# Altium schematic sheet MidDout.SchDoc
size A4
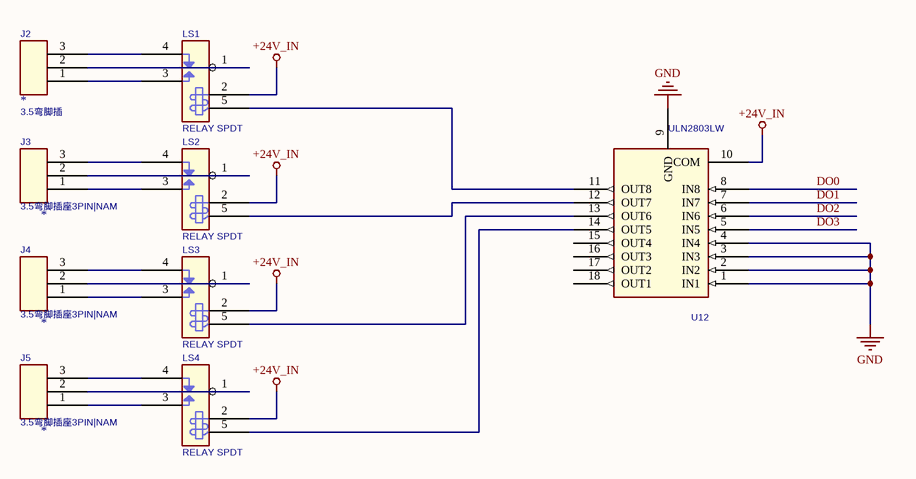
[diagram p0: MidDout.SchDoc]

## Parts
J2  *  [3.5-P3]
J3  *  [3.5-P3]
J4  *  [3.5-P3]
J5  *  [3.5-P3]
LS1  RELAY SPDT  [RELAY_OMRON_G5LE-14]
LS2  RELAY SPDT  [RELAY_OMRON_G5LE-14]
LS3  RELAY SPDT  [RELAY_OMRON_G5LE-14]
LS4  RELAY SPDT  [RELAY_OMRON_G5LE-14]
U12  ULN2803LW  [SO18WN]

## Nets
+24V_IN: LS1.2(COIL2) LS2.2(COIL2) LS3.2(COIL2) LS4.2(COIL2) U12.10(COM)
GND: U12.1(IN1) U12.2(IN2) U12.3(IN3) U12.4(IN4) U12.9(GND)
DO0: U12.8(IN8)
DO1: U12.7(IN7)
DO2: U12.6(IN6)
DO3: U12.5(IN5)
NetJ2_1: J2.1 LS1.3(NO)
NetJ2_2: J2.2 LS1.1(COMMON)
NetJ2_3: J2.3 LS1.4(NC)
NetJ3_1: J3.1 LS2.3(NO)
NetJ3_2: J3.2 LS2.1(COMMON)
NetJ3_3: J3.3 LS2.4(NC)
NetJ4_1: J4.1 LS3.3(NO)
NetJ4_2: J4.2 LS3.1(COMMON)
NetJ4_3: J4.3 LS3.4(NC)
NetJ5_1: J5.1 LS4.3(NO)
NetJ5_2: J5.2 LS4.1(COMMON)
NetJ5_3: J5.3 LS4.4(NC)
NetLS1_5: LS1.5(COIL1) U12.11(OUT8)
NetLS2_5: LS2.5(COIL1) U12.12(OUT7)
NetLS3_5: LS3.5(COIL1) U12.13(OUT6)
NetLS4_5: LS4.5(COIL1) U12.14(OUT5)

Not connected (* = marked no-connect by the designer): U12 15(OUT4) 16(OUT3) 17(OUT2) 18(OUT1)

## Notes on the sheet
- (in symbol CON3) 3.5弯脚插; 3.5弯脚插座3PIN|NAM

## Library data of the parts
J2-J5 = CON3: PCB Footprint SMD: 插件; TOLERANCE: =J57_TOLERANCE
LS1-LS4 = RELAY SPDT_1
U12 = ULN2803: PCB Footprint SMD: SMD; TOLERANCE: =U21_TOLERANCE